# EAGLE design Delta_Robot (EAGLE 9.6.2)
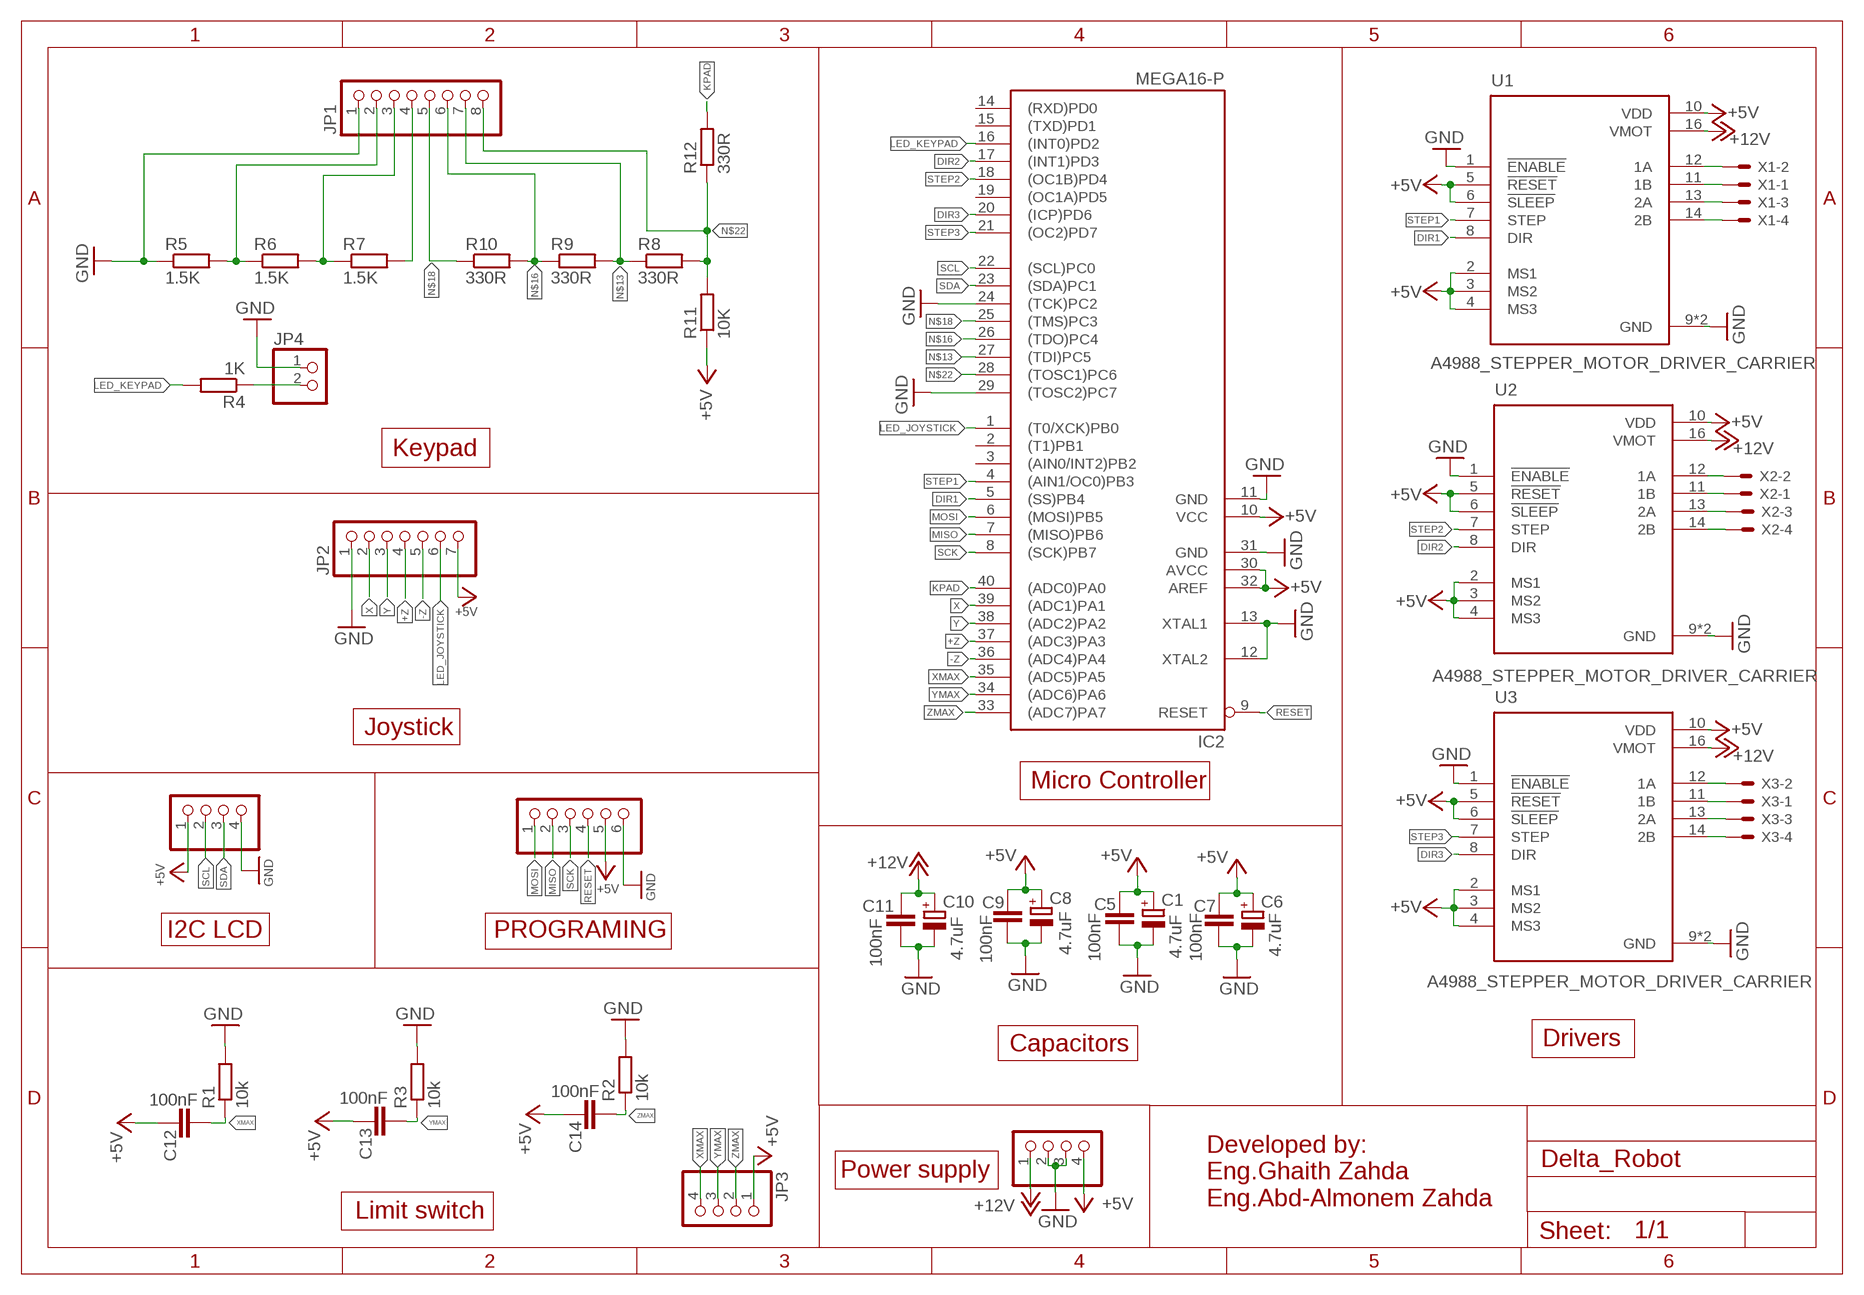
[diagram p0: schematic, sheet 1]

## Parts
C1  4.7uF  CPOL-EUE2.5-5  [E2,5-5]
C5  100nF  C-EU025-024X044  [C025-024X044]
C6  4.7uF  CPOL-EUE2.5-5  [E2,5-5]
C7  100nF  C-EU025-024X044  [C025-024X044]
C8  4.7uF  CPOL-EUE2.5-5  [E2,5-5]
C9  100nF  C-EU025-024X044  [C025-024X044]
C10  4.7uF  CPOL-EUE2.5-5  [E2,5-5]
C11  100nF  C-EU025-024X044  [C025-024X044]
C12  100nF  C-EU025-024X044  [C025-024X044]
C13  100nF  C-EU025-024X044  [C025-024X044]
C14  100nF  C-EU025-024X044  [C025-024X044]
I2C_LCD  PINHD-1X4  [1X04]
IC2  MEGA16-P  [DIL40]
JP1  PINHD-1X8  [1X08]
JP2  PINHD-1X7  [1X07]
JP3  PINHD-1X4  [1X04]
JP4  PINHD-1X2  [1X02]
POWER  PINHD-1X4  [1X04]
PROGRAMING  PINHD-1X6  [1X06]
R1  10k  R-EU_0204/5  [0204/5]
R2  10k  R-EU_0204/5  [0204/5]
R3  10k  R-EU_0204/5  [0204/5]
R4  1K  R-EU_0204/5  [0204/5]
R5  1.5K  R-EU_0204/5  [0204/5]
R6  1.5K  R-EU_0204/5  [0204/5]
R7  1.5K  R-EU_0204/5  [0204/5]
R8  330R  R-EU_0204/5  [0204/5]
R9  330R  R-EU_0204/5  [0204/5]
R10  330R  R-EU_0204/5  [0204/5]
R11  10K  R-EU_0204/5  [0204/5]
R12  330R  R-EU_0204/5  [0204/5]
U1  A4988_STEPPER_MOTOR_DRIVER_CARRIER  [MODULE_A4988_STEPPER_MOTOR_DRIVER_CARRIER]
U2  A4988_STEPPER_MOTOR_DRIVER_CARRIER  [MODULE_A4988_STEPPER_MOTOR_DRIVER_CARRIER]
U3  A4988_STEPPER_MOTOR_DRIVER_CARRIER  [MODULE_A4988_STEPPER_MOTOR_DRIVER_CARRIER]
X1  JST-XH-04-PIN-LONG-PAD  [JST-XH-04-PACKAGE-LONG-PAD]
X2  JST-XH-04-PIN-LONG-PAD  [JST-XH-04-PACKAGE-LONG-PAD]
X3  JST-XH-04-PIN-LONG-PAD  [JST-XH-04-PACKAGE-LONG-PAD]

## Nets
+5V: C1.+ C5.2 C6.+ C7.2 C8.+ C9.2 C12.2 C13.2 C14.2 I2C_LCD.1 IC2.10(VCC) IC2.30(AVCC) IC2.32(AREF) JP2.7 JP3.1 POWER.4 PROGRAMING.5 R11.1 U1.2(MS1) U1.3(MS2) U1.4(MS3) U1.5(!RESET) U1.6(!SLEEP) U1.10(VDD) U2.2(MS1) U2.3(MS2) U2.4(MS3) U2.5(!RESET) U2.6(!SLEEP) U2.10(VDD) U3.2(MS1) U3.3(MS2) U3.4(MS3) U3.5(!RESET) U3.6(!SLEEP) U3.10(VDD)
+12V: C10.+ C11.2 POWER.1 U1.16(VMOT) U2.16(VMOT) U3.16(VMOT)
+Z: IC2.37((ADC3)PA3) JP2.4
-Z: IC2.36((ADC4)PA4) JP2.5
DIR1: IC2.5((SS)PB4) U1.8(DIR)
DIR2: IC2.17((INT1)PD3) U2.8(DIR)
DIR3: IC2.20((ICP)PD6) U3.8(DIR)
GND: C1.- C5.1 C6.- C7.1 C8.- C9.1 C10.- C11.1 I2C_LCD.4 IC2.11(GND) IC2.12(XTAL2) IC2.13(XTAL1) IC2.24((TCK)PC2) IC2.29((TOSC2)PC7) IC2.31(GND) JP1.1 JP2.1 JP4.1 POWER.2 POWER.3 PROGRAMING.6 R1.2 R2.2 R3.2 R5.1 U1.1(!ENABLE) U1.9(GND) U1.15(GND) U2.1(!ENABLE) U2.9(GND) U2.15(GND) U3.1(!ENABLE) U3.9(GND) U3.15(GND)
KPAD: IC2.40((ADC0)PA0) R12.2
LED_JOYSTICK: IC2.1((T0/XCK)PB0) JP2.6
LED_KEYPAD: IC2.16((INT0)PD2) R4.2
MISO: IC2.7((MISO)PB6) PROGRAMING.2
MOSI: IC2.6((MOSI)PB5) PROGRAMING.1
N$1: JP4.2 R4.1
N$2: U3.12(1A) X3.2
N$3: JP1.2 R5.2 R6.1
N$4: U1.11(1B) X1.1
N$5: U1.12(1A) X1.2
N$6: U1.13(2A) X1.3
N$7: U1.14(2B) X1.4
N$8: U2.11(1B) X2.1
N$9: U2.12(1A) X2.2
N$10: U2.13(2A) X2.3
N$11: U2.14(2B) X2.4
N$12: U3.11(1B) X3.1
N$13: IC2.27((TDI)PC5) JP1.7 R8.1 R9.2
N$14: U3.13(2A) X3.3
N$15: U3.14(2B) X3.4
N$16: IC2.26((TDO)PC4) JP1.6 R9.1 R10.2
N$17: JP1.3 R6.2 R7.1
N$18: IC2.25((TMS)PC3) JP1.5 R10.1
N$20: JP1.4 R7.2
N$22: IC2.28((TOSC1)PC6) JP1.8 R8.2 R11.2 R12.1
RESET: IC2.9(RESET) PROGRAMING.4
SCK: IC2.8((SCK)PB7) PROGRAMING.3
SCL: I2C_LCD.2 IC2.22((SCL)PC0)
SDA: I2C_LCD.3 IC2.23((SDA)PC1)
STEP1: IC2.4((AIN1/OC0)PB3) U1.7(STEP)
STEP2: IC2.18((OC1B)PD4) U2.7(STEP)
STEP3: IC2.21((OC2)PD7) U3.7(STEP)
X: IC2.39((ADC1)PA1) JP2.2
XMAX: C12.1 IC2.35((ADC5)PA5) JP3.4 R1.1
Y: IC2.38((ADC2)PA2) JP2.3
YMAX: C13.1 IC2.34((ADC6)PA6) JP3.3 R3.1
ZMAX: C14.1 IC2.33((ADC7)PA7) JP3.2 R2.1
Unconnected: IC2.2((T1)PB1) IC2.3((AIN0/INT2)PB2) IC2.14((RXD)PD0) IC2.15((TXD)PD1) IC2.19((OC1A)PD5)

## Notes on the sheet
- Keypad
- Joystick
- Micro Controller
- I2C LCD | PROGRAMING
- Capacitors | Drivers
- Power supply
- Developed by:
  Eng.Ghaith Zahda
  Eng.Abd-Almonem Zahda
- Limit switch

## Library data of the parts
C1 C6 C8 C10 = rcl:CPOL-EU: POLARIZED CAPACITOR, European symbol; SPICEPREFIX: C
C5 C7 C9 C11-C14 = rcl:C-EU: CAPACITOR, European symbol; SPICEPREFIX: C
I2C_LCD JP3 POWER = pinhead:PINHD-1X4: PIN HEADER
IC2 = atmel:MEGA16-P: MICROCONTROLLER 16 Kbytes FLASH 1 kbytes SRAM 512 bytes EEPROM USART 8-channel 10 bit ADC Source: avr.lbr; MPN: ATMEGA16-16PU; OC_FARNELL: 9171142; OC_NEWARK: 01M6885
JP1 = pinhead:PINHD-1X8: PIN HEADER
JP2 = pinhead:PINHD-1X7: PIN HEADER
JP4 = pinhead:PINHD-1X2: PIN HEADER
PROGRAMING = pinhead:PINHD-1X6: PIN HEADER
R1-R12 = rcl:R-EU_: RESISTOR, European symbol; SPICEPREFIX: R
U1-U3 = A4988_STEPPER_MOTOR_DRIVER_CARRIER:A4988_STEPPER_MOTOR_DRIVER_CARRIER: Stepper motor controler; IC: A4988; 1A; Uin mot: 8÷35V Check availability <https://pricing.snapeda.com/parts/A4988%20STEPPER%20MOTOR%20DRIVER%20CARRIER/Pololu/view-part?ref=eda>; AVAILABILITY: Not in stock; CHECK_PRICES: https://www.snapeda.com/parts/A4988%20STEPPER%20MOTOR%20DRIVER%20CARRIER/Pololu/view-part/?ref=eda; DESCRIPTION: Stepper Motor Driver; MF: Pololu; MP: A4988 STEPPER MOTOR DRIVER CARRIER; PACKAGE: None; PRICE: None; SNAPEDA_LINK: https://www.snapeda.com/parts/A4988%20STEPPER%20MOTOR%20DRIVER%20CARRIER/Pololu/view-part/?ref=snap
X1-X3 = Rembrandt Electronics - JST XH Connectors v1-0:JST-XH-04-PIN: JST XH Connector 2 Pin Wire to board connector. Pitch: 2,54 mm, (0.100") Number of pins: 4 Created by Rembrandt Electronics www.rembrandtelectronics.com

## Board
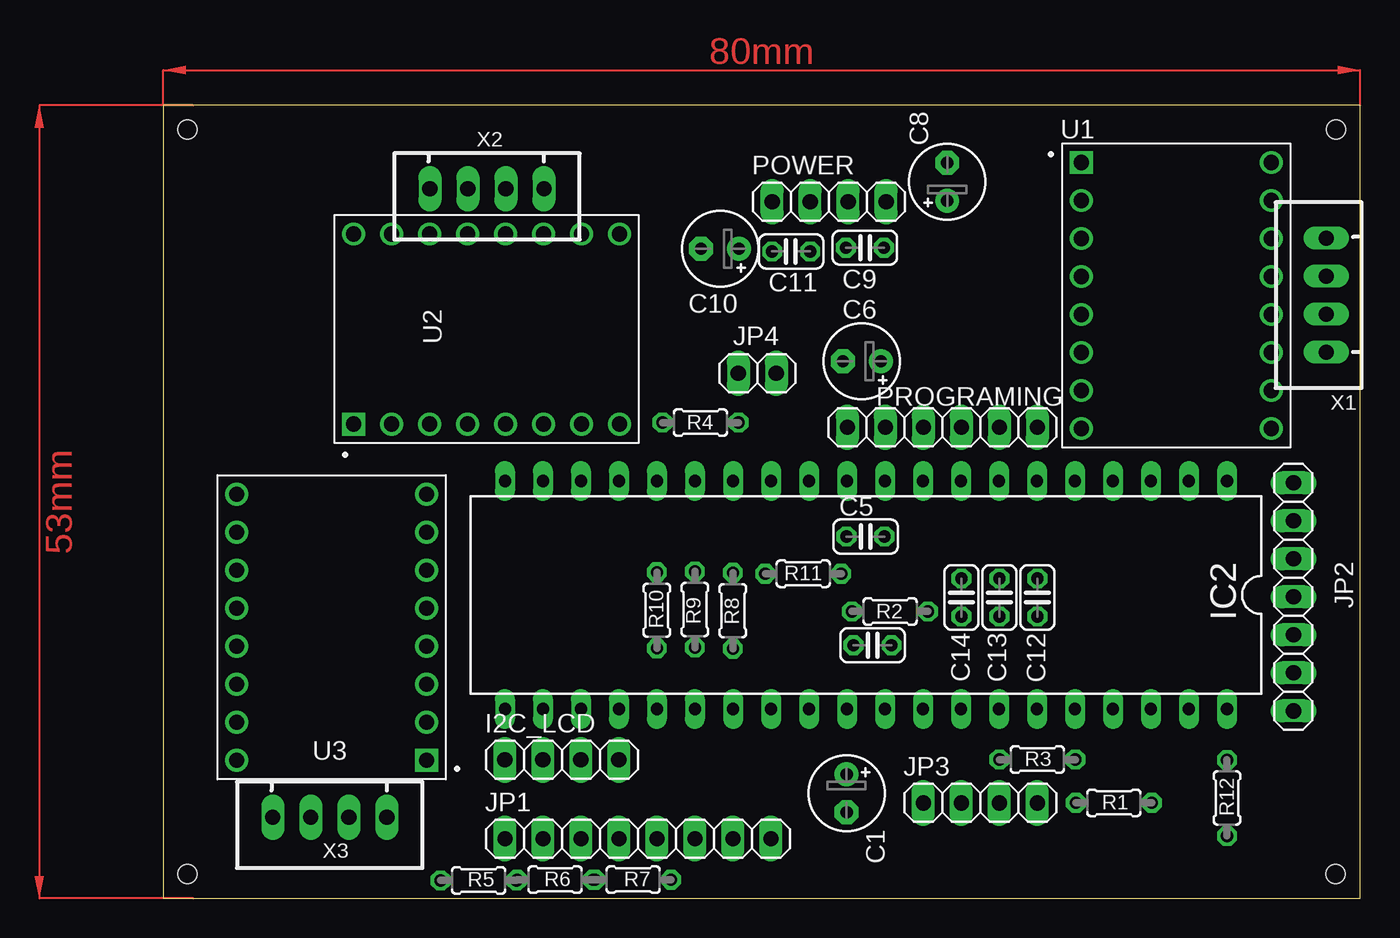
[diagram p1: board, top side]
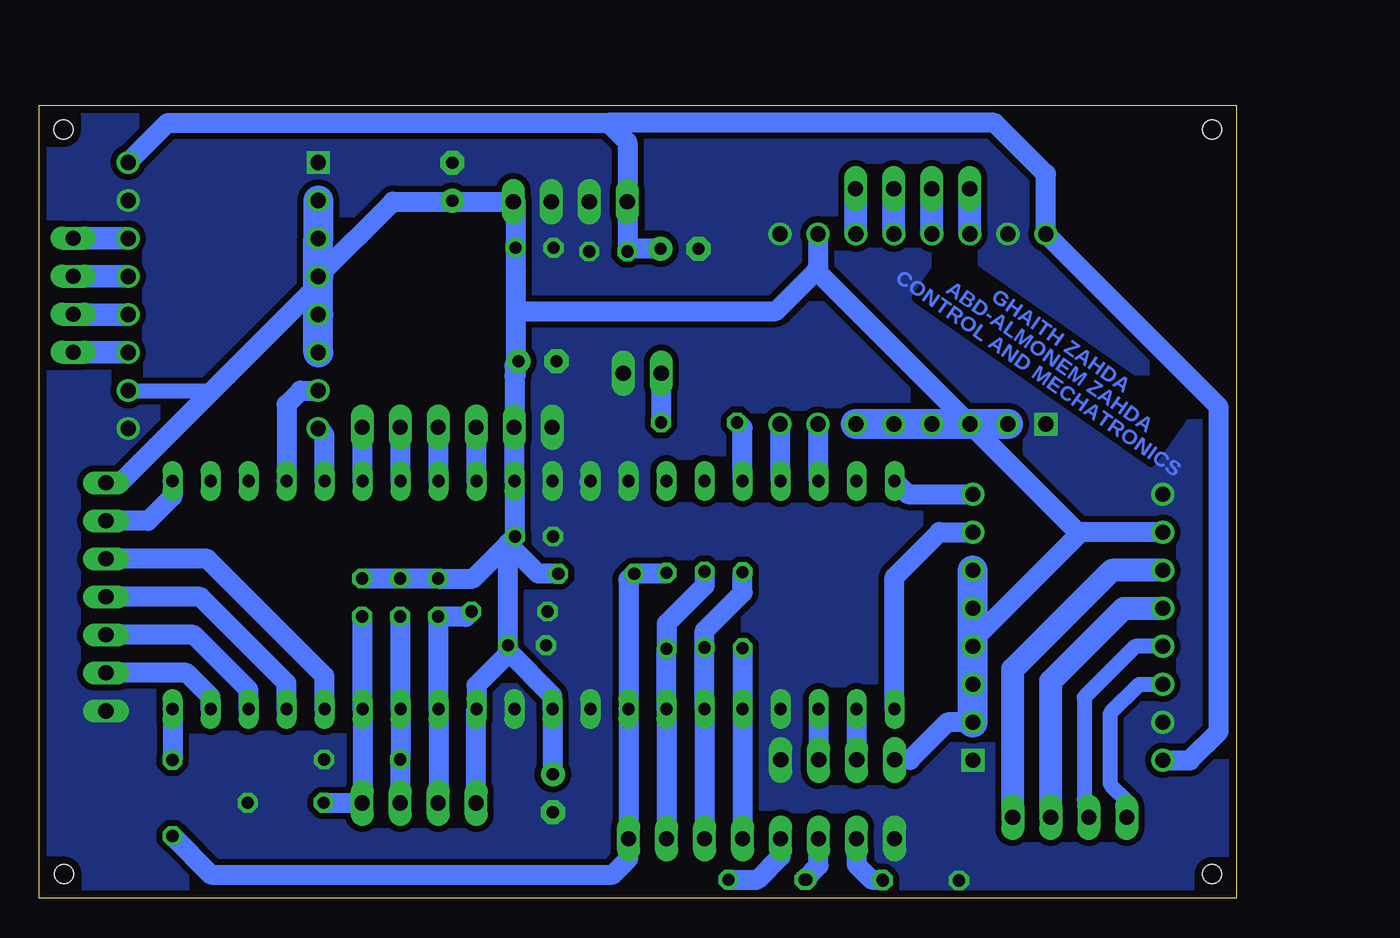
[diagram p2: board, bottom side, seen from below]

Size 80 x 53 mm. Coordinates in mm from the lower left corner, seen from the top.
Outline: 0,0 80,0 80,53 0,53 0,0
Copper layers (1*16): Top 0.035mm / dielectric 1.5mm / Bottom 0.035mm
Design rules "default *": minimum track width 0.5mm, minimum drill 0.35mm, track to track 6mil, track to pad 6mil, pad to pad 6mil, via to via 6mil, smd to smd 6mil, copper to edge 20mil, drill to drill 6mil, minimum pad ring 10mil, minimum via ring 8mil, stop-mask expansion 2mil, vias tented up to drill 0mil, thermal gap 10mil
Holes 1.27 mm at 78.36,1.65 78.38,51.37 1.6,51.39 1.63,1.63

### Footprints (pad centres in the part's own frame; a part is rotated, then mirrored left to right if it is on the bottom)
E2,5-5 = drill 0.813 pad 1.6: + -1.27,0 | drill 0.813 pad 1.6 octagon: - 1.27,0
C025-024X044 = drill 0.813 octagon: 1 -1.27,0; 2 1.27,0
1X04 = drill 1.016 long: 1 -3.81,0; 2 -1.27,0; 3 1.27,0; 4 3.81,0
DIL40 = drill 0.813 long: 1 -24.13,-7.62; 2 -21.59,-7.62; 3 -19.05,-7.62; 4 -16.51,-7.62; 5 -13.97,-7.62; 6 -11.43,-7.62; 7 -8.89,-7.62; 8 -6.35,-7.62; 9 -3.81,-7.62; 10 -1.27,-7.62; 11 1.27,-7.62; 12 3.81,-7.62; 13 6.35,-7.62; 14 8.89,-7.62; 15 11.43,-7.62; 16 13.97,-7.62; 17 16.51,-7.62; 18 19.05,-7.62; 19 21.59,-7.62; 20 24.13,-7.62; 21 24.13,7.62; 22 21.59,7.62; 23 19.05,7.62; 24 16.51,7.62; 25 13.97,7.62; 26 11.43,7.62; 27 8.89,7.62; 28 6.35,7.62; 29 3.81,7.62; 30 1.27,7.62; 31 -1.27,7.62; 32 -3.81,7.62; 33 -6.35,7.62; 34 -8.89,7.62; 35 -11.43,7.62; 36 -13.97,7.62; 37 -16.51,7.62; 38 -19.05,7.62; 39 -21.59,7.62; 40 -24.13,7.62
1X08 = drill 1.016 long: 1 -8.89,0; 2 -6.35,0; 3 -3.81,0; 4 -1.27,0; 5 1.27,0; 6 3.81,0; 7 6.35,0; 8 8.89,0
1X07 = drill 1.016 long: 1 -7.62,0; 2 -5.08,0; 3 -2.54,0; 4 0,0; 5 2.54,0; 6 5.08,0; 7 7.62,0
1X02 = drill 1.016 long: 1 -1.27,0; 2 1.27,0
1X06 = drill 1.016 long: 1 -6.35,0; 2 -3.81,0; 3 -1.27,0; 4 1.27,0; 5 3.81,0; 6 6.35,0
0204/5 = drill 0.813 octagon: 1 -2.54,0; 2 2.54,0
MODULE_A4988_STEPPER_MOTOR_DRIVER_CARRIER = drill 1.02 square: 1 -6.35,8.89 | drill 1.02: 2 -6.35,6.35; 3 -6.35,3.81; 4 -6.35,1.27; 5 -6.35,-1.27; 6 -6.35,-3.81; 7 -6.35,-6.35; 8 -6.35,-8.89; 9 6.35,-8.89; 10 6.35,-6.35; 11 6.35,-3.81; 12 6.35,-1.27; 13 6.35,1.27; 14 6.35,3.81; 15 6.35,6.35; 16 6.35,8.89
JST-XH-04-PACKAGE-LONG-PAD = drill 1.016 long: 1 -3.81,0; 2 -1.27,0; 3 1.27,0; 4 3.81,0

### Placement (x,y rotation side)
C1  45.68,7.04 270 top
C5  46.94,24.18 0 top
C6  46.69,35.9 180 top
C7  47.41,16.92 0 top
C8  52.39,47.89 90 top
C9  46.89,43.49 0 top
C10  37.22,43.41 180 top
C11  41.96,43.23 180 top
C12  58.42,20.11 90 top
C13  55.88,20.11 90 top
C14  53.34,20.11 90 top
I2C_LCD  26.64,9.26 0 top
IC2  46.97,20.28 180 top
JP1  31.72,4 0 top
JP2  75.54,20.15 90 top
JP3  54.61,6.38 0 top
JP4  39.7,35.1 180 top
POWER  44.5,46.56 0 top
PROGRAMING  52.07,31.48 180 top
R1  63.53,6.39 0 top
R2  48.58,19.18 180 top
R3  58.42,9.28 0 top
R4  35.9,31.8 180 top
R5  21.08,1.2 0 top
R6  26.18,1.25 0 top
R7  31.41,1.25 0 top
R8  38.07,19.23 90 top
R9  35.53,19.31 90 top
R10  32.99,19.26 90 top
R11  42.77,21.7 180 top
R12  71.1,6.72 90 top
U1  67.71,40.29 0 top
U2  21.61,38.05 90 top
U3  11.25,18.12 180 top
X1  77.74,40.31 90 top
X2  21.63,47.43 180 top
X3  11.13,5.43 180 top

### Tracks (layer width: path | path; a pad name or v marks a point on that pad's centre or on a via)
+5V
  Bottom 1: U1.10 68.44,33.94 67.44,34.94
  Bottom 1.321: 48.24,31.46 IC2.10 48.24,24.15 | 48.24,31.46 PROGRAMING.5 | U3.2 19.29,11.77 21.8,9.26 I2C_LCD.1 | C1.+ 45.7,8.33 IC2.30 45.7,13.52 48.68,16.5 C7.2 | C7.2 48.68,16.34 50.78,14.24 IC2.32 50.8,12.63 JP3.1 | C7.2 48.68,23.71 | 48.24,24.15 C5.2 | R11.1 46.66,21.7 48.68,23.71 | C12.2 C13.2 C14.2 51.01,21.38 48.68,23.71 | 48.24,24.15 48.68,23.71 | U3.10 10.37,24.47 10.47,24.37 | 10.47,24.37 U2.3 28.06,41.96 | U3.4 17.6,17.24 10.47,24.37 | 52.33,46.56 56.37,46.56 U1.4 61.36,41.02 67.44,34.94 74.61,27.77 JP2.7 | 52.33,46.56 POWER.4 48.16,46.56 C9.2 48.16,39.24 | 48.24,34.92 48.24,31.46 | 48.24,34.92 48.24,35.62 C6.+ 48.16,36.1 | 48.24,34.92 48.22,34.91 48.16,34.97 48.16,36.1 | C8.+ 52.33,46.56 | 48.16,39.24 48.16,36.1 | 28.06,41.96 30.77,39.24 48.16,39.24 | U2.10 27.96,42.06 28.06,41.96
  Bottom 2: U3.2 U3.3 U3.4 U3.5 U3.6 | U2.2 U2.3 U2.4 U2.5 U2.6 | U1.6 U1.5 U1.4 U1.3 U1.2
+12V
  Bottom 1.321: U1.16 71.41,51.83 41.98,51.83 | 41.98,51.83 40.7,50.55 POWER.1 C11.2 40.7,43.41 C10.+ | U3.16 3.09,9.23 1.17,11.15 1.17,32.85 U2.16 12.72,48.4 16.15,51.83 41.98,51.83
+Z
  Bottom 1.321: IC2.37 63.48,14.39 69.24,20.15 JP2.4
-Z
  Bottom 1.321: IC2.36 60.94,14.85 68.78,22.69 JP2.5
DIR1
  Bottom 1.321: IC2.5 60.94,30.98 U1.8
DIR2
  Bottom 1.321: IC2.17 30.46,31.66 U2.8
DIR3
  Bottom 1.321: IC2.20 21.95,27.01 U3.8
GND
  Bottom 1.321: IC2.12 43.22,27.83
  pour Bottom (isolate 0.406, no thermals): -2.39,56.24 -2.39,-2.87 84.93,-2.87 84.93,56.24
KPAD
  Bottom 1.321: IC2.40 R12.2
LED_JOYSTICK
  Bottom 1.321: IC2.1 71.1,26.86 72.73,25.23 JP2.6
LED_KEYPAD
  Bottom 1.321: IC2.16 33,31.44 R4.2
MISO
  Bottom 1.321: IC2.7 55.86,31.46 PROGRAMING.2
MOSI
  Bottom 1.321: IC2.6 58.4,31.46 PROGRAMING.1
N$1
  Bottom 1.321: JP4.2 R4.1
N$2
  Bottom 1.524: X3.2 12.4,14.52 7.52,19.39 U3.12
N$3
  Bottom 1.321: JP1.2 25.38,2.25 24.38,1.25 R6.1 23.64,1.22 R5.2
N$4
  Bottom 1.5: X1.1 74.09,36.51 U1.11
N$5
  Bottom 1.5: U1.12 77.71,39.02 X1.2
N$6
  Bottom 1.5: X1.3 74.09,41.59 U1.13
N$7
  Bottom 1.5: U1.14 77.71,44.1 X1.4
N$8
  Bottom 1.524: X2.1 25.44,44.42 U2.11
N$9
  Bottom 1.524: X2.2 22.9,44.42 U2.12
N$10
  Bottom 1.524: X2.3 20.36,44.42 U2.13
N$11
  Bottom 1.524: X2.4 17.82,44.42 U2.14
N$12
  Bottom 1.524: X3.1 14.94,15.32 8.32,21.93 U3.11
N$13
  Bottom 1.321: JP1.7 IC2.27 R8.1 38.07,18.36 35.53,20.9 R9.2
N$14
  Bottom 1: U3.13 6.75,16.85 10.16,13.44 10.16,6.6 9.86,6.3 X3.3
N$15
  Bottom 1: X3.4 7.32,6.53 8.4,7.61 8.4,12.4 6.49,14.31 U3.14
N$16
  Bottom 1.321: JP1.6 IC2.26 R9.1 35.53,17.9 32.99,20.44 R10.2
N$17
  Bottom 1.321: JP1.3 27.91,2.21 R7.1 R6.2
N$18
  Bottom 1.321: JP1.5 IC2.25 33,16.71 R10.1
N$20
  Bottom 1.321: R7.2 32.01,1.25 30.45,2.81 JP1.4
N$22
  Bottom 1.321: JP1.8 IC2.28 40.62,21.31 R11.2 38.14,21.7 R8.2 | JP1.8 | R12.1 68.52,1.6 41.67,1.6 40.62,2.66 JP1.8
RESET
  Bottom 1.321: IC2.9 50.78,31.46 PROGRAMING.4
SCK
  Bottom 1.321: IC2.8 53.32,31.46 PROGRAMING.3
SCL
  Bottom 1.321: IC2.22 25.38,9.27 I2C_LCD.2
SDA
  Bottom 1.321: IC2.23 27.92,9.27 I2C_LCD.3
STEP1
  Bottom 1.321: IC2.4 63.48,33 62.55,33.94 U1.7
STEP2
  Bottom 1.321: IC2.18 27.92,31.66 U2.7
STEP3
  Bottom 1.321: IC2.21 22.84,21.48 19.85,24.47 U3.7
X
  Bottom 1.321: IC2.39 68.56,13.47 70.16,15.07 JP2.2
XMAX
  Bottom 1.321: JP3.4 | R1.1 JP3.4 | JP3.4 58.4,6.41 IC2.35 58.42,12.69 C12.1
Y
  Bottom 1.321: IC2.38 66.02,13.93 69.7,17.61 JP2.3
YMAX
  Bottom 1.321: JP3.3 R3.1 55.86,9.3 IC2.34 55.86,18.81 C13.1
ZMAX
  Bottom 1.321: JP3.2 53.32,6.41 IC2.33 53.32,18.81 | 53.32,18.81 C14.1 | R2.1 51.48,18.81 53.32,18.81
(copper drawn outside any net)
  shapes: Top area x2

### Text on the board
Bottom: GHAITH ZAHDA / ABD-ALMONEM ZAHDA / CONTROL AND MECHATRONICS